# Altium schematic sheet 3 mcu.SchDoc
size A4; SheetNumber: 3; SheetTotal: 6
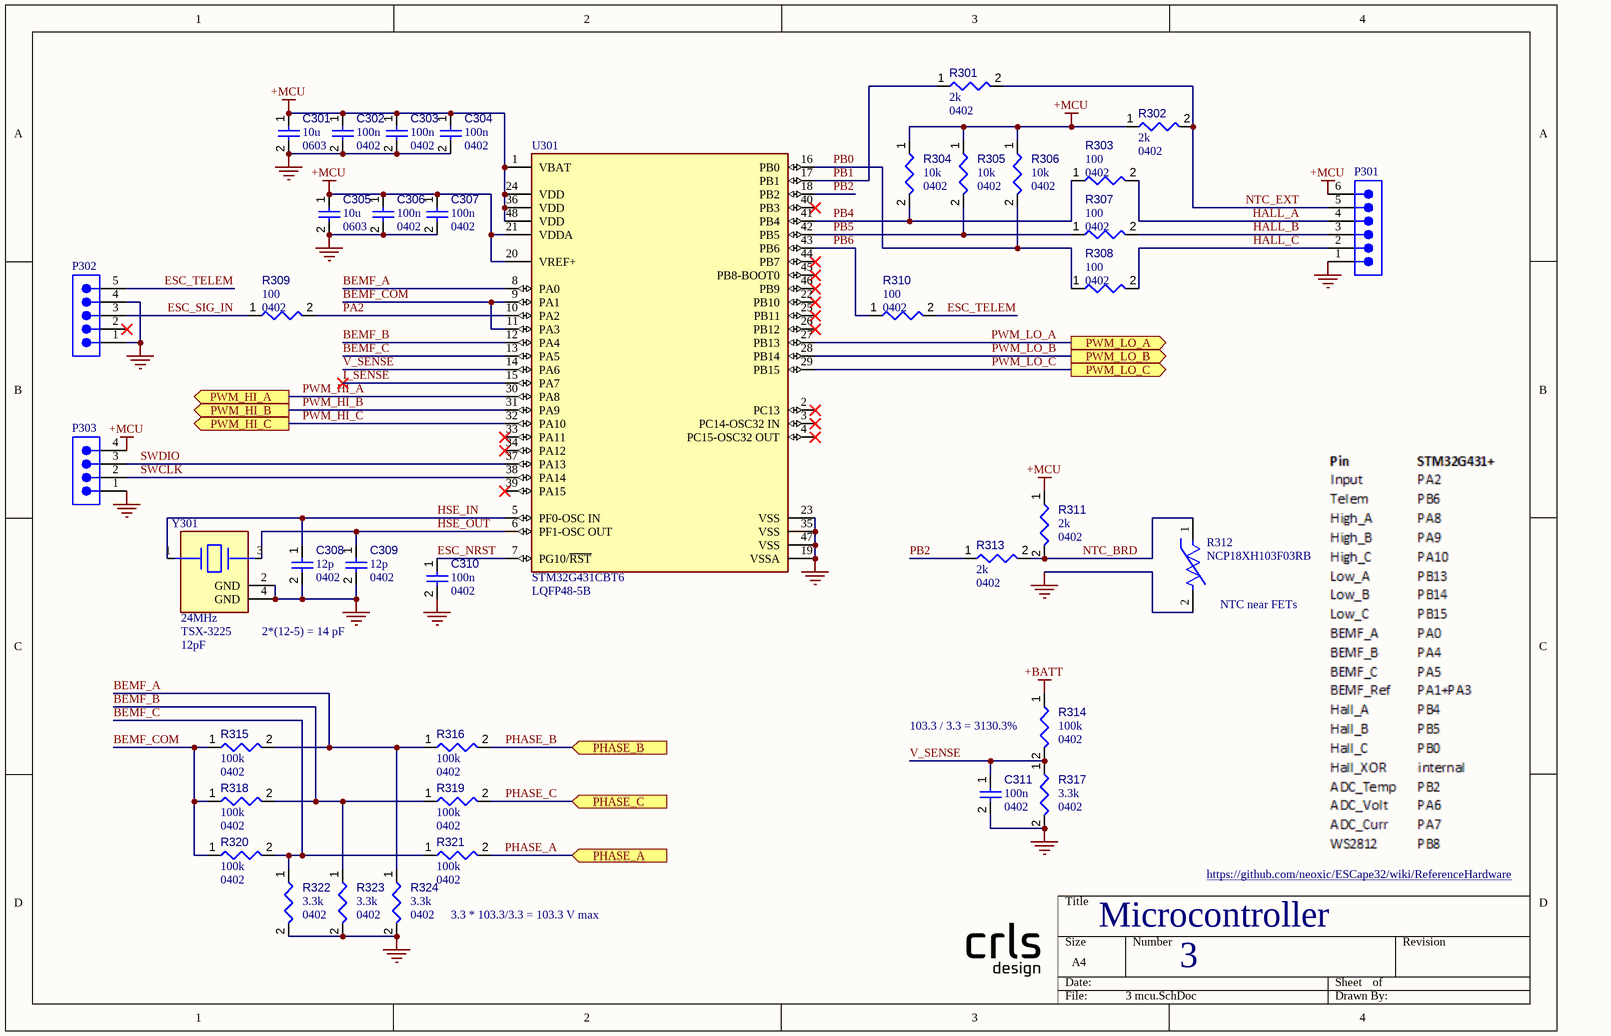
[diagram p0: 3 mcu.SchDoc]

## Parts
C301  value 10u  Case/Package: 0603  [CAPC0603(1608)100_L]  (hidden comment: Capacitors,ceramic,0603,20%,10u,25V)
C302  value 100n  Case/Package: 0402  [CAPC0402(1005)60_L]  (hidden comment: Capacitors,ceramic,0402,20%,100n,16V)
C303  value 100n  Case/Package: 0402  [CAPC0402(1005)60_L]  (hidden comment: Capacitors,ceramic,0402,20%,100n,16V)
C304  value 100n  Case/Package: 0402  [CAPC0402(1005)60_L]  (hidden comment: Capacitors,ceramic,0402,20%,100n,16V)
C305  value 10u  Case/Package: 0603  [CAPC0603(1608)100_L]  (hidden comment: Capacitors,ceramic,0603,20%,10u,25V)
C306  value 100n  Case/Package: 0402  [CAPC0402(1005)60_L]  (hidden comment: Capacitors,ceramic,0402,20%,100n,16V)
C307  value 100n  Case/Package: 0402  [CAPC0402(1005)60_L]  (hidden comment: Capacitors,ceramic,0402,20%,100n,16V)
C308  value 12p  Case/Package: 0402  [CAPC0402(1005)60_L]  (hidden comment: Capacitors,ceramic,0402,10%,12p,50V)
C309  value 12p  Case/Package: 0402  [CAPC0402(1005)60_L]  (hidden comment: Capacitors,ceramic,0402,10%,12p,50V)
C310  value 100n  Case/Package: 0402  [CAPC0402(1005)60_L]  (hidden comment: Capacitors,ceramic,0402,20%,100n,16V)
C311  value 100n  Case/Package: 0402  [CAPC0402(1005)60_L]  (hidden comment: Capacitors,ceramic,0402,20%,100n,16V)
P301  61300611121  [61300611121]  (value not drawn)
P302  61300511121  [61300511121]  (value not drawn)
P303  61300411121  [61300411121]  (value not drawn)
R301  value 2k  Case/Package: 0402  [RESC0402(1005)_L]  (hidden comment: Resistors,0402,1%,2k)
R302  value 2k  Case/Package: 0402  [RESC0402(1005)_L]  (hidden comment: Resistors,0402,1%,2k)
R303  value 100  Case/Package: 0402  [RESC0402(1005)_L]  (hidden comment: Resistors,0402,1%,100)
R304  value 10k  Case/Package: 0402  [RESC0402(1005)_L]  (hidden comment: Resistors,0402,1%,10k)
R305  value 10k  Case/Package: 0402  [RESC0402(1005)_L]  (hidden comment: Resistors,0402,1%,10k)
R306  value 10k  Case/Package: 0402  [RESC0402(1005)_L]  (hidden comment: Resistors,0402,1%,10k)
R307  value 100  Case/Package: 0402  [RESC0402(1005)_L]  (hidden comment: Resistors,0402,1%,100)
R308  value 100  Case/Package: 0402  [RESC0402(1005)_L]  (hidden comment: Resistors,0402,1%,100)
R309  value 100  Case/Package: 0402  [RESC0402(1005)_L]  (hidden comment: Resistors,0402,1%,100)
R310  value 100  Case/Package: 0402  [RESC0402(1005)_L]  (hidden comment: Resistors,0402,1%,100)
R311  value 2k  Case/Package: 0402  [RESC0402(1005)_L]  (hidden comment: Resistors,0402,1%,2k)
R312  NCP18XH103F03RB  [FP-NCP18-0_15-MFG]
R313  value 2k  Case/Package: 0402  [RESC0402(1005)_L]  (hidden comment: Resistors,0402,1%,2k)
R314  value 100k  Case/Package: 0402  [RESC0402(1005)_L]  (hidden comment: Resistors,0402,1%,100k)
R315  value 100k  Case/Package: 0402  [RESC0402(1005)_L]  (hidden comment: Resistors,0402,1%,100k)
R316  value 100k  Case/Package: 0402  [RESC0402(1005)_L]  (hidden comment: Resistors,0402,1%,100k)
R317  value 3.3k  Case/Package: 0402  [RESC0402(1005)_L]  (hidden comment: Resistors,0402,1%,3.3k)
R318  value 100k  Case/Package: 0402  [RESC0402(1005)_L]  (hidden comment: Resistors,0402,1%,100k)
R319  value 100k  Case/Package: 0402  [RESC0402(1005)_L]  (hidden comment: Resistors,0402,1%,100k)
R320  value 100k  Case/Package: 0402  [RESC0402(1005)_L]  (hidden comment: Resistors,0402,1%,100k)
R321  value 100k  Case/Package: 0402  [RESC0402(1005)_L]  (hidden comment: Resistors,0402,1%,100k)
R322  value 3.3k  Case/Package: 0402  [RESC0402(1005)_L]  (hidden comment: Resistors,0402,1%,3.3k)
R323  value 3.3k  Case/Package: 0402  [RESC0402(1005)_L]  (hidden comment: Resistors,0402,1%,3.3k)
R324  value 3.3k  Case/Package: 0402  [RESC0402(1005)_L]  (hidden comment: Resistors,0402,1%,3.3k)
U301  STM32G431CBT6  Package: LQFP48-5B  [FP-LQFP48-5B-MFG]
Y301  Frequency: 24MHz  Series: TSX-3225  [FP-TSX-3225-MFG]  (hidden comment: TSX-3225 24.0000MF20G-AC3)

## Ports
PHASE_A (in), PHASE_B (in), PHASE_C (in), PWM_HI_A (out), PWM_HI_B (out), PWM_HI_C (out), PWM_LO_A (out), PWM_LO_B (out), PWM_LO_C (out)

## Nets
+BATT: R314.1
+MCU: C301.1 C302.1 C303.1 C304.1 C305.1 C306.1 C307.1 P301.6 P303.4 R302.1 R304.1 R305.1 R306.1 R311.1 U301.1(VBAT) U301.20(VREF+) U301.21(VDDA) U301.24(VDD) U301.36(VDD) U301.48(VDD)
GND: C301.2 C302.2 C303.2 C304.2 C305.2 C306.2 C307.2 C308.2 C309.2 C310.2 C311.2 P301.1 P302.1 P302.4 P303.1 R312.2 R317.2 R322.2 R323.2 R324.2 U301.19(VSSA) U301.23(VSS) U301.35(VSS) U301.47(VSS) Y301.2(GND) Y301.4(GND)
BEMF_A: R315.2 R316.1 R324.1 U301.8(PA0)
BEMF_B: R318.2 R319.1 R323.1 U301.12(PA4)
BEMF_C: R320.2 R321.1 R322.1 U301.13(PA5)
BEMF_COM: R315.1 R318.1 R320.1 U301.9(PA1) U301.11(PA3)
ESC_NRST: C310.1 U301.7(PG10/~{RST})
ESC_SIG_IN: P302.3 R309.1
ESC_TELEM: P302.5 R310.2
HALL_A: P301.4 R303.2
HALL_B: P301.3 R307.2
HALL_C: P301.2 R308.2
HSE_IN: C308.1 U301.5(PF0-OSC_IN) Y301.1
HSE_OUT: C309.1 U301.6(PF1-OSC_OUT) Y301.3
I_SENSE: U301.15(PA7)
NTC_BRD: R311.2 R312.1 R313.2
NTC_EXT: P301.5 R301.2 R302.2
PA2: R309.2 U301.10(PA2)
PB0: R306.2 R308.1 U301.16(PB0)
PB1: R301.1 U301.17(PB1)
PB2: R313.1 U301.18(PB2)
PB4: R303.1 R304.2 U301.41(PB4)
PB5: R305.2 R307.1 U301.42(PB5)
PB6: R310.1 U301.43(PB6)
PHASE_A: R321.2 ; port PHASE_A
PHASE_B: R316.2 ; port PHASE_B
PHASE_C: R319.2 ; port PHASE_C
PWM_HI_A: U301.30(PA8) ; port PWM_HI_A
PWM_HI_B: U301.31(PA9) ; port PWM_HI_B
PWM_HI_C: U301.32(PA10) ; port PWM_HI_C
PWM_LO_A: U301.27(PB13) ; port PWM_LO_A
PWM_LO_B: U301.28(PB14) ; port PWM_LO_B
PWM_LO_C: U301.29(PB15) ; port PWM_LO_C
SWCLK: P303.2 U301.38(PA14)
SWDIO: P303.3 U301.37(PA13)
V_SENSE: C311.1 R314.2 R317.1 U301.14(PA6)

Not connected (* = marked no-connect by the designer): P302 2*; U301 2(PC13)* 3(PC14-OSC32_IN)* 4(PC15-OSC32_OUT)* 22(PB10)* 25(PB11)* 26(PB12)* 33(PA11)* 34(PA12)* 39(PA15)* 40(PB3)* 44(PB7)* 45(PB8-BOOT0)* 46(PB9)*

## Notes on the sheet
- (near Y301) 12pF
- (near Y301) 2*(12-5) = 14 pF
- (near R312) NTC near FETs
- (near R314) 103.3 / 3.3 = 3130.3%
- 3.3 * 103.3/3.3 = 103.3 V max
- https://github.com/neoxic/ESCape32/wiki/ReferenceHardware
- Microcontroller

## Library data of the parts
C301-C311 = Capacitors: Capacitor; Capacitor Type: ceramic; Component Type: Capacitors
  C301 C305: Voltage Rating: 25V; Tolerance: 20%
  C302-C304 C306 C307 C310 C311: Voltage Rating: 16V; Tolerance: 20%
  C308 C309: Voltage Rating: 50V; Tolerance: 10%
P301 = CMP-1502-01070-3: NexarPartId: 20084590; Current Rating: 3A; Pitch: 2.54mm; Gender: Male; Operating Supply Voltage: 250V; Connector Type: Male Pin; Number of Positions: 6; Contact Resistance: 20mΩ; Packaging: Bulk; Number of Pins: 6; Number of Rows: 1; Contact Plating: Gold; Lead Free: Lead Free; RoHS: Compliant; Contact Mating Length: 5.9944mm; Voltage Rating: 250V; REACH SVHC: Unknown; Contact Gender: Male; Housing Material: PBT; Min Operating Temperature: -40°C; Lead Pitch: 2.54mm; Mount: Through Hole; Number of Contacts: 6; Max Operating Temperature: 105°C; Contact Material: Copper; Orientation: Vertical; Termination: Through Hole; Color: Black; Height: 8.89mm
P302 = CMP-1502-01068-3: NexarPartId: 32855526; Connector Type: Male Pin; Gender: Male; Contact Resistance: 20mΩ; Pitch: 2.54mm; Operating Supply Voltage: 250V; Current Rating: 3A; Number of Contacts: 5; Lead Free: Lead Free; Color: Black; Packaging: Bulk; Lead Pitch: 2.54mm; Contact Material: Copper; Min Operating Temperature: -40°C; Contact Mating Length: 5.9944mm; Voltage Rating: 250V; Number of Pins: 5; Number of Positions: 5; Height: 8.89mm; Orientation: Vertical; REACH SVHC: Unknown; RoHS: Compliant; Contact Plating: Gold; Max Operating Temperature: 105°C; Mount: Through Hole; Number of Rows: 1; Termination: Solder
P303 = CMP-1502-01064-3: NexarPartId: 32855522; Operating Supply Voltage: 250V; Pitch: 2.54mm; Contact Resistance: 20mΩ; Number of Positions: 4; Current Rating: 3A; Connector Type: Male Pin; Gender: Male; Contact Plating: Gold; Height: 8.89mm; Lead Pitch: 2.54mm; Lead Free: Lead Free; Contact Mating Length: 5.9944mm; Number of Rows: 1; Termination: Solder; Packaging: Bulk; REACH SVHC: Unknown; Min Operating Temperature: -40°C; RoHS: Compliant; Number of Contacts: 4; Voltage Rating: 250V; Color: Black; Max Operating Temperature: 105°C; Contact Material: Copper; Mount: Through Hole; Orientation: Vertical; Number of Pins: 4
R301-R311 R313-R324 = Resistors: Resistor; Tolerance: 1%; Component Type: Resistors
R312 = CMP-2000-05271-3: NTC Thermistor for Temperature Sensor, 0603, 10kΩ, 1%, 0.1mA, 5V; Manufacturer Series: NCP18; Accuracy: 0.7%; Current Rating: 310uA; Max Power Dissipation: 100mW; Thermistor Application: TEMPERATURE COMPENSATION; Number of Terminals/Pins: 2; Resistance: 10kR; Case Code (Metric): 1608; RoHS Compliant: Yes; Max Operating Temperature: 125°C; Resistance Tolerance: 1%; Case/Package: 0603; Mount: Surface Mount; Lead Free: Lead Free; Min Operating Temperature: -40°C; REACH SVHC: No SVHC; Package Shape: Rectangular; Radiation Hardening: No; Series: NCP; Depth: 0.8mm; Number of Pins: 2; Length: 1.6mm; Height: 0.8mm; Terminal Placement: Dual; Tolerance: 1%; Case Code (Imperial): 0603; Terminal Finish: Tin; Power Rating: 100mW; Termination: SMD/SMT; Packaging: Tape and Reel; Package Quantity: 1
U301 = CMP-12105-000030-1: MAINSTREAM ARM CORTEX-M4+ MCU 17; Manufacturer: STMicroelectronics; Number Of Adc Channels: 17; Number Of I/Os: 38; Standoff Height: 0.05mm; Number Of Usb Channels: 1; Data Bus Width: 32bits; Number Of I2C Channels: 3; Number Of Pwm Channels: 31; Frequency: 170MHz; Memory Type: FLASH; Number Of Timers/Counters: 14; Ram Size: 32KBytes; Max Junction Temp: +105°C; Memory Size: 128KBytes; Min Supply Voltage: 1.62V; Max Supply Voltage: 3.6V; Number Of Uart Channels: 4; Interface: I2C,SPI,UART,USART,CAN,USB,LIN,IrDA,I2S; Temperature Range Low: -40°C; Lead Free: Yes; Device Class L3: Microcontrollers; Number Of Cores: 1; Temperature Range High: +85°C; Height: 1.6mm; Digikey Description: MAINSTREAM ARM CORTEX-M4+ MCU 17; Device Class L1: Integrated Circuits (ICs); RoHS: TRUE; Number Of A/D Converters: 1; Core Architecture: Arm Cortex-M4; Device Class L2: Embedded Processors and Controllers; ComponentLink2Description: Datasheet; Temperature: -40°C to +85°C; Ambient Temperature Range High: +85°C; Ambient Temperature Range Low: -40°C; Octopart: https://octopart.com/stm32g431cbt6-stmicroelectronics-98835224; ComponentLink2URL: https://www.st.com/resource/en/datasheet/stm32g431cb.pdf; Automotive: No; Number Of Spi Channels: 3; Manufacturer Part Number: STM32G431CBT6; Category: IC
Y301 = CMP-36405-000018-1: CRYSTAL 24.0000MHZ 9PF SMD; ESR (Equivalent Series Resistance): 40R; Frequency Stability: 20ppm; Tolerance: 10ppm; Drive Level: 200uW; Min Operating Temperature: -40°C; RoHS Compliant: Yes; Width: 2.5mm; Max Operating Temperature: 105°C; Package Quantity: 250; Load Capacitance: 9pF; Mount: Surface Mount; Lead Free: Lead Free; Height: 0.024inch; Depth: 2.5mm; Packaging: Tape and Reel; Weight: 0.000564oz; Number of Pins: 4; Termination: SMD/SMT; Case/Package: SMD/SMT; Length: 3.2mm; Frequency Tolerance: 10ppm